# Altium project MSXIV_Rear_Power_Distribution.PrjPcb (part 4 of 4)

## Sheet Power Distribution - Output to front Power Board.SchDoc: Output to Front Power Distribution
size B; Organization: Midnight Sun Solar Rayce Car Team; Address1: University of Waterloo; Address2: 200 University Ave W; Address3: Waterloo, ON, Canada; Address4: N2L 3E9; Website: www.uwmidsun.com; ProjectName: ProjectName
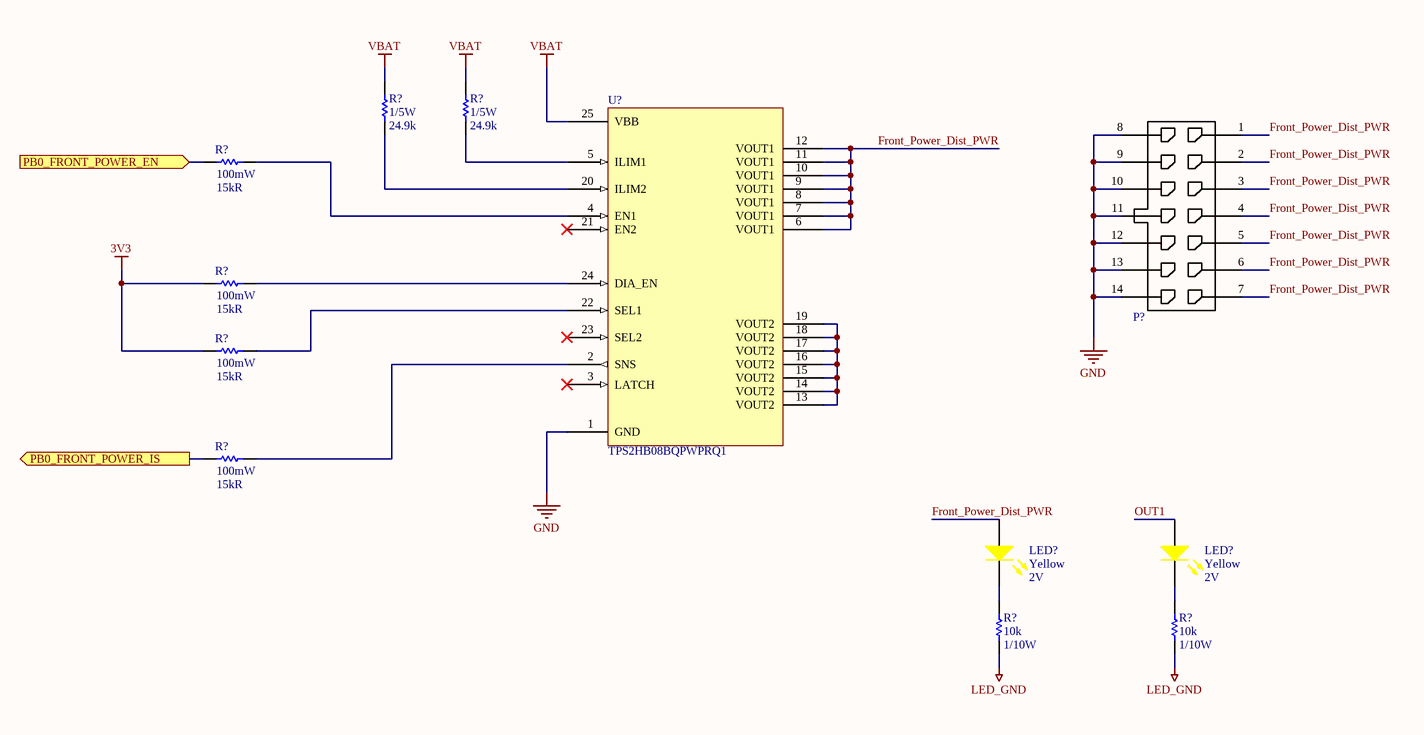
[diagram p14: Power Distribution - Output to front Power Board.SchDoc]

### Parts
(Parts that share a designator on the sheet are numbered #1, #2 ... from top to bottom, then left to right.)
LED?#3  Color: Yellow  Voltage - Forward (Vf) (Typ): 2V  [LED_0603]  (hidden comment: LED YELLOW CLEAR 2.1V 0603)
LED?#4  Color: Yellow  Voltage - Forward (Vf) (Typ): 2V  [LED_0603]  (hidden comment: LED YELLOW CLEAR 2.1V 0603)
P?#9  CONN 14POS MICRO-FIT 3mm  [CONN, 14POS MICRO-FIT 3mm]  (value not drawn)
R?#20  Power: 1/5W  Resistance: 24.9k  [RES, 0603]  (hidden comment: RES 24.9K OHM 0.1% 1/5W 0603)
R?#21  Power: 1/5W  Resistance: 24.9k  [RES, 0603]  (hidden comment: RES 24.9K OHM 0.1% 1/5W 0603)
R?#22  Power Rating: 100mW  Resistance: 15kR  [RES, 0603]  (hidden comment: RES SMD 15K OHM 1% 1/10W 0603)
R?#23  Power Rating: 100mW  Resistance: 15kR  [RES, 0603]  (hidden comment: RES SMD 15K OHM 1% 1/10W 0603)
R?#24  Power Rating: 100mW  Resistance: 15kR  [RES, 0603]  (hidden comment: RES SMD 15K OHM 1% 1/10W 0603)
R?#25  Power Rating: 100mW  Resistance: 15kR  [RES, 0603]  (hidden comment: RES SMD 15K OHM 1% 1/10W 0603)
R?#26  Resistance: 10k  Power: 1/10W  [RES, 0603]  (hidden comment: RES 10K OHM 1% 1/10W 0603)
R?#27  Resistance: 10k  Power: 1/10W  [RES, 0603]  (hidden comment: RES 10K OHM 1% 1/10W 0603)
U?#6  Manufacturer Part Number: TPS2HB08BQPWPRQ1  [IC TPS2HB08-Q1 PowerPAD TSSOP-24]  (hidden comment: IC LOAD SWITCH TPS2HB08BQPWPRQ1 24-TSSOP)

### Ports
PB0_FRONT_POWER_EN (in), PB0_FRONT_POWER_IS (out)

### Nets
3V3: R?#23.1 R?#24.1
GND: P?#9.8 P?#9.9 P?#9.10 P?#9.11 P?#9.12 P?#9.13 P?#9.14 U?#6.1(GND)  [project net AUX_BAT_IN]
LED_GND: R?#26.2 R?#27.2
VBAT: R?#20.2 R?#21.2 U?#6.25(VBB)
Front_Power_Dist_PWR: LED?#3.1(A) P?#9.1 P?#9.2 P?#9.3 P?#9.4 P?#9.5 P?#9.6 P?#9.7 U?#6.6(VOUT1) U?#6.7(VOUT1) U?#6.8(VOUT1) U?#6.9(VOUT1) U?#6.10(VOUT1) U?#6.11(VOUT1) U?#6.12(VOUT1)
OUT1: LED?#4.1(A)
NetLED?#3_2: LED?#3.2(K) R?#26.1
NetLED?#4_2: LED?#4.2(K) R?#27.1
NetR?#20_1: R?#20.1 U?#6.20(ILIM2)
NetR?#21_1: R?#21.1 U?#6.5(ILIM1)
NetR?#22_1: R?#22.1 ; port PB0_FRONT_POWER_EN
NetR?#22_2: R?#22.2 U?#6.4(EN1)
NetR?#23_2: R?#23.2 U?#6.24(DIA_EN)
NetR?#24_2: R?#24.2 U?#6.22(SEL1)
NetR?#25_1: R?#25.1 ; port PB0_FRONT_POWER_IS
NetR?#25_2: R?#25.2 U?#6.2(SNS)
NetU?#6_13: U?#6.13(VOUT2) U?#6.14(VOUT2) U?#6.15(VOUT2) U?#6.16(VOUT2) U?#6.17(VOUT2) U?#6.18(VOUT2) U?#6.19(VOUT2)

Not connected (* = marked no-connect by the designer): U?#6 3(LATCH)* 21(EN2)* 23(SEL2)*

### Notes on the sheet
- PROJECT
- DOCUMENT
- DRAWN BY
- LAST MODIFIED
- PART NUMBER
- REVISION
- SHEET
- VARIANT
- OF
- Engineering 5 - 1002
  University of Waterloo
  (519) 888-4567 x32978
  hardware@uwmidsun.com

### Library data of the parts
LED?#3 LED?#4 = LED YELLOW CLEAR 2.1V 0603: Yellow 590nm LED Indication - Discrete 2V 0603 (1608 Metric); Manufacturer: Wurth Electronics Inc.; Manufacturer Part Number: 150060YS75000; Lens Color: Colorless; Millicandela Rating: 120mcd; Lens Style/Size: Rectangle with Flat Top, 1.10mm x 0.70mm; Current - Test: 20mA; Viewing Angle: 140°; Wavelength - Peak: 595nm; Supplier 1: Digi-Key; RoHS: RoHS Compliant; Category: Optoelectronics; Stock 1: 10523; Pricing 1: 1=0.21, 100=0.1617, 500=0.13964 (CAD); Packaging: Cut Tape (CT); Part Status: Active; Lens Transparency: Clear; Mounting Type: Surface Mount; Wavelength - Dominant: 590nm; Features: -; Package / Case: 0603 (1608 Metric); Supplier Device Package: 0603; Size / Dimension: 1.60mm L x 0.80mm W; Height (Max): 0.80mm; ComponentLink1URL: http://katalog.we-online.de/led/datasheet/150060YS75000.pdf; ComponentLink1Description: http://katalog.we-online.de/led/datasheet/150060YS75000.pdf; Supplier Part Number 1: 732-4981-1-ND
P?#9 = CONN 14POS MICRO-FIT 3mm: Connector Header Through Hole 14 position 0.118" (3.00mm); Manufacturer: Molex, LLC; Manufacturer Part Number: 0430451427; Number of Positions: 14; Number of Positions Loaded: All; Style: Board to Cable/Wire; Shrouding: Shrouded - 4 Wall; Contact Length - Post: 0.125" (3.18mm); Material Flammability Rating: UL94 V-0; Supplier 1: Digi-Key; RoHS: RoHS Compliant; Category: Connectors, Interconnects; Stock 1: 829; Pricing 1: 1=4.57, 10=4.377, 25=4.0124, 50=3.8296, 100=3.6473, 250=3.1914, 936=2.82666, 1872=2.5531, 2808=2.46192 (CAD); Packaging: Tray; Part Status: Active; Connector Type: Header; Contact Type: Male Pin; Pitch - Mating: 0.118" (3.00mm); Number of Rows: 2; Row Spacing - Mating: 0.118" (3.00mm); Mounting Type: Through Hole; Termination: Solder; Fastening Type: Locking Ramp; Contact Length - Mating: -; Overall Contact Length: -; Insulation Height: 0.390" (9.91mm); Contact Shape: Square; Contact Finish - Mating: Tin; Contact Finish Thickness - Mating: 60.0µin (1.52µm); Contact Finish - Post: Tin; Contact Material: Brass; Insulation Material: Liquid Crystal Polymer (LCP), Glass Filled; Features: Board Guide; Operating Temperature: -; Ingress Protection: -; Insulation Color: Black; Current Rating: -; Voltage Rating: -; Mated Stacking Heights: -; Contact Finish Thickness - Post: -; Applications: General Purpose, Medical, Military, Telecommunications; ComponentLink1URL: https://www.molex.com/pdm_docs/sd/430451427_sd.pdf; ComponentLink1Description: https://www.molex.com/pdm_docs/sd/430451427_sd.pdf; Supplier Part Number 1: WM10707-ND
R?#20 R?#21 = RES 24.9K OHM 0.1% 1/5W 0603: 24.9 kOhms ±0.1% 0.2W, 1/5W Chip Resistor 0603 (1608 Metric) Automotive AEC-Q200, Pulse Withstanding Thick Film; Manufacturer: Panasonic; Manufacturer Part Number: ERJPB3B2492V; Max Power Dissipation: 200mW; Temperature Coefficient: 50ppm/°C; Supplier 1: Digi-Key; Supplier Part Number 1: P20129CT-ND; Stock 1: 2; Pricing 1: 1=0.25000, 10=0.21100, 25=0.15320, 50=0.11100, 100=0.08230, 250=0.06316, 500=0.04976, 1000=0.03445 (USD); RoHS: Yes; Case/Package: 0603; Case Code (Metric): 1608; Case Code (Imperial): 0603; Min Operating Temperature: -55°C; Max Operating Temperature: 155°C; Packaging: Tape and Reel; Composition: Thick Film; Number of Terminations: 2; Tolerance: 0.1%; Features: Automotive AEC-Q200; Length: 0.063inch; Width: 0.032inch; Height - Seated (Max): 0.022inch; ComponentLink1URL: http://www.farnell.com/datasheets/2286937.pdf?src-supplier=Farnell; ComponentLink1Description: http://www.farnell.com/datasheets/2286937.pdf?src-supplier=Farnell; ComponentLink2URL: https://industrial.panasonic.com/sa/system/files/data/download/catalog/id_fixed-resistors_e_2.pdf?src-supplier=Digi-Key; ComponentLink2Description: https://industrial.panasonic.com/sa/system/files/data/download/catalog/id_fixed-resistors_e_2.pdf?src-supplier=Digi-Key; ComponentLink3URL: https://industrial.panasonic.com/cdbs/www-data/pdf/RDM0000/DMM0000COL5.pdf?src-supplier=Digi-Key; ComponentLink3Description: https://industrial.panasonic.com/cdbs/www-data/pdf/RDM0000/DMM0000COL5.pdf?src-supplier=Digi-Key; ComponentLink4URL: http://www.farnell.com/datasheets/2286937.pdf?src-supplier=Newark; ComponentLink4Description: http://www.farnell.com/datasheets/2286937.pdf?src-supplier=Newark
R?#22-R?#25 = RES SMD 15K OHM 1% 1/10W 0603: 15 kOhms ±1% 0.1W, 1/10W Chip Resistor 0603 (1608 Metric) Moisture Resistant Thick Film; Manufacturer: Yageo; Manufacturer Part Number: RC0603FR-0715KL; Temperature Coefficient: 100ppm/°C; Voltage Rating (DC): 50V; Supplier 1: Digi-Key; RoHS: Yes; Stock 1: 8520111; Pricing 1: 1 = 0.10000, 10 = 0.02400, 100 = 0.00970, 1000 = 0.00437, 2500 = 0.00379 (USD); Case/Package: 0603; Number of Pins: 2; Case Code (Metric): 1608; Case Code (Imperial): 0603; Min Operating Temperature: -55°C; Max Operating Temperature: 155°C; Tolerance: 1%; Packaging: Tape and Reel; Composition: Thick Film; Package Quantity: 1; Voltage Rating: 50V; Number of Terminations: 2; Termination: SMD/SMT; Military Standard: Not; Max Power Dissipation: 100mW; Features: Moisture Resistant; Length: 1.6mm; Height: 0.022inch; Width: 0.031inch; Depth: 0.8mm; REACH SVHC: Unknown; Lead Free: Lead Free; ComponentLink1URL: http://www.yageo.com/documents/recent/PYu-RC_Group_51_RoHS_L_10.pdf; ComponentLink1Description: http://www.yageo.com/documents/recent/PYu-RC_Group_51_RoHS_L_10.pdf; ComponentLink2URL: http://www.yageo.com/documents/recent/PYu-RC_Group_51_RoHS_L_9.pdf; ComponentLink2Description: http://www.yageo.com/documents/recent/PYu-RC_Group_51_RoHS_L_9.pdf; ComponentLink3URL: https://www.verical.com/server-webapp/html/getDatasheet?partID=327895; ComponentLink3Description: https://www.verical.com/server-webapp/html/getDatasheet?partID=327895; Supplier Part Number 1: 311-15.0KHRCT-ND
R?#26 R?#27 = RES 10K OHM 1% 1/10W 0603: RES SMD 10K OHM 1% 1/10W 0603; Manufacturer 1: Yageo; Manufacturer Part Number 1: RC0603FR-0710KL; Temperature Coefficient: ±100ppm/°C; Supplier 1: Digi-Key; Supplier Part Number 1: 311-10.0KHRCT-ND; Packaging: Cut Tape (CT); Part Status: Active; Composition: Thick Film; Operating Temperature: -55°C ~ 155°C; Package / Case: 0603 (1608 Metric); Supplier Device Package: 0603; Size / Dimension: 0.063" L x 0.031" W (1.60mm x 0.80mm); Height - Seated (Max): 0.022" (0.55mm); Failure Rate: -; ComponentLink1URL: http://www.yageo.com/documents/recent/PYu-RC_Group_51_RoHS_L_7.pdf; ComponentLink1Description: http://www.yageo.com/documents/recent/PYu-RC_Group_51_RoHS_L_7.pdf; Tolerance: ±1%
U?#6 = IC LOAD SWITCH TPS2HB08BQPWPRQ1 24-TSSOP: Power Switch ICs - Power Distribution HYDRA 8 MOHM OTP B; Manufacturer: Texas Instruments; Supplier 1: Mouser; Supplier Part Number 1: 595-TPS2HB08BQPWPRQ1; Stock 1: 1455; Pricing 1: 1=6.26000, 10=5.63000, 50=5.63000, 100=4.61000, 1000=3.31000, 10000=3.14000 (USD); ComponentLink1URL: https://octopart.com/click/track?ak=2673a2b2&ct=datasheets&sig=00f1c14&at=physicalpart&sid=370&ppid=97400712&hlid=26833906&src-supplier=TI+store; ComponentLink1Description: https://octopart.com/click/track?ak=2673a2b2&ct=datasheets&sig=00f1c14&at=physicalpart&sid=370&ppid=97400712&hlid=26833906&src-supplier=TI+store; ComponentLink2URL: http://sigma.octopart.com/49250897/technical_drawing/Texas-Instruments-TPS2HB08BQPWPRQ1.pdf?src-supplier=TI+store; ComponentLink2Description: http://sigma.octopart.com/49250897/technical_drawing/Texas-Instruments-TPS2HB08BQPWPRQ1.pdf?src-supplier=TI+store

## Sheet Power Distribution - External ADC.SchDoc: External ADC
size B; Organization: Midnight Sun Solar Rayce Car Team; Address1: University of Waterloo; Address2: 200 University Ave W; Address3: Waterloo, ON, Canada; Address4: N2L 3E9; Website: www.uwmidsun.com; ProjectName: ProjectName
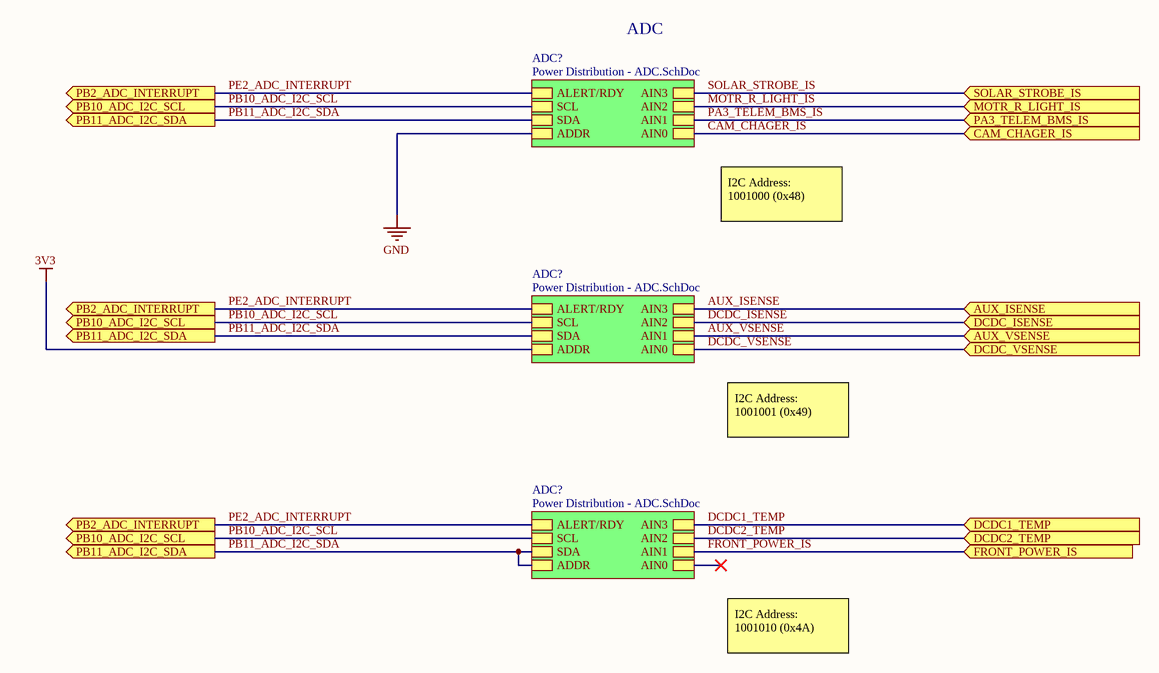
[diagram p15: Power Distribution - External ADC.SchDoc]

### Sub-sheets
ADC? = Power Distribution - ADC.SchDoc: ALERT/RDY, SCL, SDA, ADDR, AIN3, AIN2, AIN1, AIN0
ADC? = Power Distribution - ADC.SchDoc: ALERT/RDY, SCL, SDA, ADDR, AIN3, AIN2, AIN1, AIN0
ADC? = Power Distribution - ADC.SchDoc: ALERT/RDY, SCL, SDA, ADDR, AIN3, AIN2, AIN1, AIN0

### Ports
AUX_ISENSE (in), AUX_VSENSE (in), CAM_CHAGER_IS (in), DCDC1_TEMP (in), DCDC2_TEMP (in), DCDC_ISENSE (in), DCDC_VSENSE (in), FRONT_POWER_IS (in), MOTR_R_LIGHT_IS (in), PA3_TELEM_BMS_IS (in), PB2_ADC_INTERRUPT (out), PB10_ADC_I2C_SCL (out), PB11_ADC_I2C_SDA (out), SOLAR_STROBE_IS (in)

### Nets
AUX_ISENSE: port AUX_ISENSE, sheet ADC?/AIN3
AUX_VSENSE: port AUX_VSENSE, sheet ADC?/AIN1
CAM_CHAGER_IS: port CAM_CHAGER_IS, sheet ADC?/AIN0
DCDC1_TEMP: port DCDC1_TEMP, sheet ADC?/AIN3
DCDC2_TEMP: port DCDC2_TEMP, sheet ADC?/AIN2
DCDC_ISENSE: port DCDC_ISENSE, sheet ADC?/AIN2
DCDC_VSENSE: port DCDC_VSENSE, sheet ADC?/AIN0
FRONT_POWER_IS: port FRONT_POWER_IS, sheet ADC?/AIN1
MOTR_R_LIGHT_IS: port MOTR_R_LIGHT_IS, sheet ADC?/AIN2
PA3_TELEM_BMS_IS: port PA3_TELEM_BMS_IS, sheet ADC?/AIN1
PB10_ADC_I2C_SCL: port PB10_ADC_I2C_SCL, sheet ADC?/SCL, sheet ADC?/SCL, sheet ADC?/SCL
PB11_ADC_I2C_SDA: port PB11_ADC_I2C_SDA, sheet ADC?/SDA, sheet ADC?/SDA, sheet ADC?/SDA, sheet ADC?/ADDR
PE2_ADC_INTERRUPT: port PB2_ADC_INTERRUPT, sheet ADC?/ALERT/RDY, sheet ADC?/ALERT/RDY, sheet ADC?/ALERT/RDY
SOLAR_STROBE_IS: port SOLAR_STROBE_IS, sheet ADC?/AIN3

### Notes on the sheet
- ADC
- I2C Address: 1001000 (0x48)
- I2C Address: 1001001 (0x49)
- I2C Address: 1001010 (0x4A)
- PROJECT
- DOCUMENT
- DRAWN BY
- LAST MODIFIED
- PART NUMBER
- REVISION
- SHEET
- VARIANT
- OF
- Engineering 5 - 1002
  University of Waterloo
  (519) 888-4567 x32978
  hardware@uwmidsun.com

## Sheet Power Distribution - ADC.SchDoc: Title
size B; Organization: Midnight Sun Solar Rayce Car Team; Address1: University of Waterloo; Address2: 200 University Ave W; Address3: Waterloo, ON, Canada; Address4: N2L 3E9; Website: www.uwmidsun.com; ProjectName: ProjectName
Used 3 times, as channels ADC?, ADC?, ADC?. Parts and nets are listed once, with the designators drawn on the sheet.
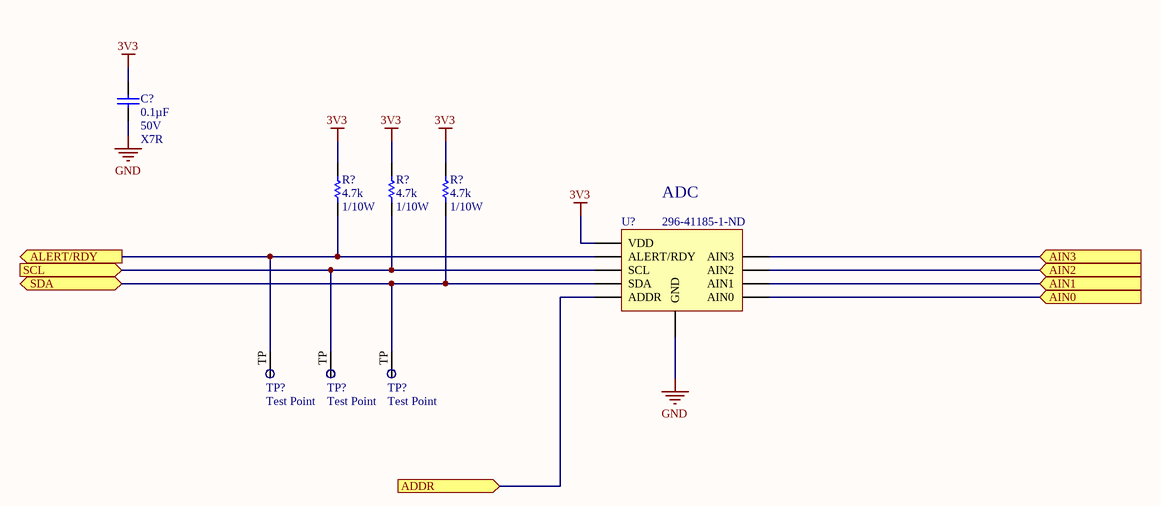
[diagram p16: Power Distribution - ADC.SchDoc]

### Parts
(Parts that share a designator on the sheet are numbered #1, #2 ... from top to bottom, then left to right.)
C?  Capacitance: 0.1µF  Voltage: 50V  Temperature Coefficient: X7R  [CAP, 0603]  (hidden comment: CAP CER 0.1UF 50V 10% X7R 0603)
R?#1  Resistance (Ohms): 4.7k  Power (Watts): 1/10W  [RES, 0603]  (hidden comment: RES 4.7K OHM 1% 1/10W 0603)
R?#2  Resistance (Ohms): 4.7k  Power (Watts): 1/10W  [RES, 0603]  (hidden comment: RES 4.7K OHM 1% 1/10W 0603)
R?#3  Resistance (Ohms): 4.7k  Power (Watts): 1/10W  [RES, 0603]  (hidden comment: RES 4.7K OHM 1% 1/10W 0603)
TP?#1  Test Point  [Test Point]  (no BOM)
TP?#2  Test Point  [Test Point]  (no BOM)
TP?#3  Test Point  [Test Point]  (no BOM)
U?  Supplier Part Number 1: 296-41185-1-ND  [IC ADC VSSOP10]  (hidden comment: Quad ADC)

### Ports
ADDR (in), AIN0 (in), AIN1 (in), AIN2 (in), AIN3 (in), ALERT/RDY (out), SCL (in), SDA (bidir)

### Nets
3V3: C?.1 R?#1.1 R?#2.1 R?#3.1 U?.8(VDD)
GND: C?.2 U?.3(GND)
ADDR: U?.1(ADDR) ; port ADDR
AIN0: U?.4(AIN0) ; port AIN0
AIN1: U?.5(AIN1) ; port AIN1
AIN2: U?.6(AIN2) ; port AIN2
AIN3: U?.7(AIN3) ; port AIN3
ALERT/RDY: R?#1.2 TP?#1.TP U?.2(ALERT/RDY) ; port ALERT/RDY
SCL: R?#2.2 TP?#2.TP U?.10(SCL) ; port SCL
SDA: R?#3.2 TP?#3.TP U?.9(SDA) ; port SDA

### Channels
ADC?: designators C?=C?_ADC?#1 R?=R?_ADC?#1 R?=R?_ADC?#2 R?=R?_ADC?#3 TP?=TP?_ADC?#3 TP?=TP?_ADC?#2 TP?=TP?_ADC?#1 U?=U?_ADC?#1; ports ADDR=AUX_BAT_IN AIN0=CAM_CHAGER_IS AIN1=PA3_TELEM_BMS_IS AIN2=MOTR_R_LIGHT_IS AIN3=SOLAR_STROBE_IS ALERT/RDY=PE2_ADC_INTERRUPT SCL=PB10_ADC_I2C_SCL SDA=PB11_ADC_I2C_SDA
ADC?: designators C?=C?_ADC?#2 R?=R?_ADC?#4 R?=R?_ADC?#5 R?=R?_ADC?#6 TP?=TP?_ADC?#6 TP?=TP?_ADC?#5 TP?=TP?_ADC?#4 U?=U?_ADC?#2; ports ADDR=3V3 AIN0=DCDC_VSENSE AIN1=AUX_VSENSE AIN2=DCDC_ISENSE AIN3=AUX_ISENSE ALERT/RDY=PE2_ADC_INTERRUPT SCL=PB10_ADC_I2C_SCL SDA=PB11_ADC_I2C_SDA
ADC?: designators C?=C?_ADC?#3 R?=R?_ADC?#7 R?=R?_ADC?#8 R?=R?_ADC?#9 TP?=TP?_ADC?#9 TP?=TP?_ADC?#8 TP?=TP?_ADC?#7 U?=U?_ADC?#3; ports ADDR=PB11_ADC_I2C_SDA AIN0=NetU?_ADC?#3_4 AIN1=FRONT_POWER_IS AIN2=DCDC2_TEMP AIN3=DCDC1_TEMP ALERT/RDY=PE2_ADC_INTERRUPT SCL=PB10_ADC_I2C_SCL SDA=PB11_ADC_I2C_SDA

### Notes on the sheet
- (near U?) ADC
- PROJECT
- DOCUMENT
- DRAWN BY
- LAST MODIFIED
- PART NUMBER
- REVISION
- SHEET
- VARIANT
- OF
- Engineering 5 - 1002
  University of Waterloo
  (519) 888-4567 x32978
  hardware@uwmidsun.com

### Library data of the parts
C? = CAP CER 0.1UF 50V 10% X7R 0603: 0.10µF ±10% 50V Ceramic Capacitor X7R 0603 (1608 Metric); Manufacturer 1: AVX Corporation; Manufacturer Part Number 1: 06035C104KAT2A; Supplier 1: Digi-Key; Supplier Part Number 1: 478-5052-1-ND; Packaging: Cut Tape (CT); Part Status: Active; Operating Temperature: -55°C ~ 125°C; Ratings: -; Mounting Type: Surface Mount, MLCC; Package / Case: 0603 (1608 Metric); Size / Dimension: 0.063" L x 0.032" W (1.60mm x 0.81mm); Height - Seated (Max): -; Thickness (Max): 0.035" (0.90mm); Lead Spacing: -; Lead Style: -; ComponentLink1URL: http://datasheets.avx.com/X7RDielectric.pdf; ComponentLink1Description: http://datasheets.avx.com/X7RDielectric.pdf; Tolerance: ±10%
R?#1-R?#3 = RES 4.7K OHM 1% 1/10W 0603: 4.7k Ohm ±1% 0.1W, 1/10W Chip Resistor 0603 (1608 Metric) Moisture Resistant Thick Film; Manufacturer 1: Yageo; Manufacturer Part Number 1: RC0603FR-074K7L; Description 1: RES SMD 4.7K OHM 1% 1/10W 0603; Temperature Coefficient: ±100ppm/°C; Supplier 1: Digi-Key; Supplier Part Number 1: 311-4.70KHRCT-ND; RoHS: RoHS Compliant; Category: Resistors; Stock 1: 3487566; Pricing 1: 1=0.16, 10=0.022, 100=0.0089, 1000=0.00402, 2500=0.00349 (CAD); Packaging: Cut Tape (CT); Part Status: Active; Composition: Thick Film; Features: Moisture Resistant; Operating Temperature: -55°C ~ 155°C; Package / Case: 0603 (1608 Metric); Supplier Device Package: 0603; Size / Dimension: 0.063" L x 0.031" W (1.60mm x 0.80mm); Height - Seated (Max): 0.022" (0.55mm); Failure Rate: -; ComponentLink1URL: http://www.yageo.com/documents/recent/PYu-RC_Group_51_RoHS_L_7.pdf; ComponentLink1Description: http://www.yageo.com/documents/recent/PYu-RC_Group_51_RoHS_L_7.pdf; Tolerance: ±1%
U? = IC ADC 12-BIT VSSOP-10: 12 Bit Analog to Digital Converter 4 Input 1 Sigma-Delta 10-VSSOP; Manufacturer: Texas Instruments; Manufacturer Part Number: ADS1015IDGSR; Number of Bits: 12; Sampling Rate (Per Second): 3.3k; Number of Inputs: 2, 4; Input Type: Differential, Single Ended; Data Interface: I²C; Configuration: MUX-PGA-ADC; Number of A/D Converters: 1; Reference Type: Internal; Voltage - Supply, Analog: 2 V ~ 5.5 V; Supplier 1: Digi-Key; RoHS: RoHS Compliant; Category: Integrated Circuits (ICs); Stock 1: 4084; Pricing 1: 1=4.25, 10=3.807, 100=3.1194, 500=2.65552, 1000=2.23959 (CAD); Packaging: Cut Tape (CT); Part Status: Active; Ratio - S/H:ADC: -; Architecture: Sigma-Delta; Voltage - Supply, Digital: 2 V ~ 5.5 V; Features: PGA, Selectable Address; Operating Temperature: -40°C ~ 125°C; Package / Case: 10-TFSOP, 10-MSOP (0.118", 3.00mm Width); Supplier Device Package: 10-VSSOP; ComponentLink1URL: http://www.ti.com/lit/ds/symlink/ads1013.pdf; ComponentLink1Description: http://www.ti.com/lit/ds/symlink/ads1013.pdf

## Sheet Power Distribution - IO Expander.SchDoc: Title
size B; Organization: Midnight Sun Solar Rayce Car Team; Address1: University of Waterloo; Address2: 200 University Ave W; Address3: Waterloo, ON, Canada; Address4: N2L 3E9; Website: www.uwmidsun.com; ProjectName: ProjectName
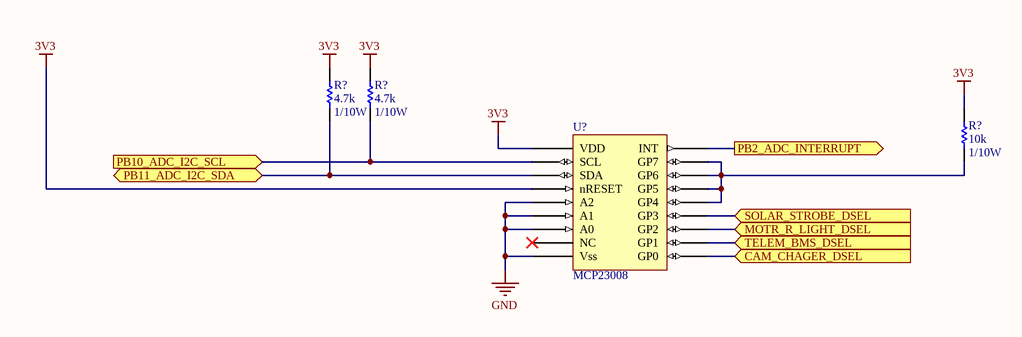
[diagram p17: Power Distribution - IO Expander.SchDoc]

### Parts
(Parts that share a designator on the sheet are numbered #1, #2 ... from top to bottom, then left to right.)
R?#28  Resistance (Ohms): 4.7k  Power (Watts): 1/10W  [RES, 0603]  (hidden comment: RES 4.7K OHM 1% 1/10W 0603)
R?#29  Resistance (Ohms): 4.7k  Power (Watts): 1/10W  [RES, 0603]  (hidden comment: RES 4.7K OHM 1% 1/10W 0603)
R?#30  Resistance: 10k  Power: 1/10W  [RES, 0603]  (hidden comment: RES 10K OHM 1% 1/10W 0603)
U?#7  MCP23008  [IC 18SOIC]

### Ports
CAM_CHAGER_DSEL (in), MOTR_R_LIGHT_DSEL (in), PB2_ADC_INTERRUPT (out), PB10_ADC_I2C_SCL (in), PB11_ADC_I2C_SDA (bidir), SOLAR_STROBE_DSEL (in), TELEM_BMS_DSEL (in)

### Nets
3V3: R?#28.1 R?#29.1 R?#30.1 U?#7.6(nRESET) U?#7.18(VDD)
GND: U?#7.3(A2) U?#7.4(A1) U?#7.5(A0) U?#7.9(Vss)  [project net AUX_BAT_IN]
NetR?#28_2: R?#28.2 U?#7.2(SDA) ; port PB11_ADC_I2C_SDA
NetR?#29_2: R?#29.2 U?#7.1(SCL) ; port PB10_ADC_I2C_SCL
NetR?#30_2: R?#30.2 U?#7.14(GP4) U?#7.15(GP5) U?#7.16(GP6) U?#7.17(GP7)
NetU?#7_8: U?#7.8(INT) ; port PB2_ADC_INTERRUPT
NetU?#7_10: U?#7.10(GP0) ; port CAM_CHAGER_DSEL
NetU?#7_11: U?#7.11(GP1) ; port TELEM_BMS_DSEL
NetU?#7_12: U?#7.12(GP2) ; port MOTR_R_LIGHT_DSEL
NetU?#7_13: U?#7.13(GP3) ; port SOLAR_STROBE_DSEL

Not connected (* = marked no-connect by the designer): U?#7 7(NC)*

### Notes on the sheet
- PROJECT
- DOCUMENT
- DRAWN BY
- LAST MODIFIED
- PART NUMBER
- REVISION
- SHEET
- VARIANT
- OF
- Engineering 5 - 1002
  University of Waterloo
  (519) 888-4567 x32978
  hardware@uwmidsun.com

### Library data of the parts
R?#28 R?#29 = RES 4.7K OHM 1% 1/10W 0603: as R?#1 on sheet Power Distribution - ADC; Supplier 1: Digi-Key; Supplier Part Number 1: 311-4.70KHRCT-ND; RoHS: RoHS Compliant; Category: Resistors; Stock 1: 3487566; Pricing 1: 1=0.16, 10=0.022, 100=0.0089, 1000=0.00402, 2500=0.00349 (CAD); Packaging: Cut Tape (CT); Part Status: Active; Composition: Thick Film; Features: Moisture Resistant; Operating Temperature: -55°C ~ 155°C; Package / Case: 0603 (1608 Metric); Supplier Device Package: 0603; Size / Dimension: 0.063" L x 0.031" W (1.60mm x 0.80mm); Height - Seated (Max): 0.022" (0.55mm); Failure Rate: -; ComponentLink1URL: http://www.yageo.com/documents/recent/PYu-RC_Group_51_RoHS_L_7.pdf; ComponentLink1Description: http://www.yageo.com/documents/recent/PYu-RC_Group_51_RoHS_L_7.pdf; Tolerance: ±1%
R?#30 = RES 10K OHM 1% 1/10W 0603: as R?#26 on sheet Power Distribution - Output to front Power Board; Supplier 1: Digi-Key; Supplier Part Number 1: 311-10.0KHRCT-ND; Packaging: Cut Tape (CT); Part Status: Active; Composition: Thick Film; Operating Temperature: -55°C ~ 155°C; Package / Case: 0603 (1608 Metric); Supplier Device Package: 0603; Size / Dimension: 0.063" L x 0.031" W (1.60mm x 0.80mm); Height - Seated (Max): 0.022" (0.55mm); Failure Rate: -; ComponentLink1URL: http://www.yageo.com/documents/recent/PYu-RC_Group_51_RoHS_L_7.pdf; ComponentLink1Description: http://www.yageo.com/documents/recent/PYu-RC_Group_51_RoHS_L_7.pdf; Tolerance: ±1%
U?#7 = IC I/O EXPANDER I2C 8B 18SOIC: MCP23008 I/O Expander 8B+1Int 18P SOIC; Manufacturer: Microchip Technology; Manufacturer Part Number: MCP23008T-E/SO; Number of I/O: 8; Interface: I²C; Interrupt Output: Yes; Output Type: Push-Pull; Current - Output Source/Sink: 25mA; Voltage - Supply: 1.8 V ~ 5.5 V; Supplier 1: Digi-Key; Supplier Part Number 1: MCP23008T-E/SOCT-ND; RoHS: RoHS Compliant; Category: Integrated Circuits (ICs); Stock 1: 5607; Pricing 1: 1=1.62, 25=1.3548, 100=1.2431 (CAD); Packaging: Cut Tape (CT); Part Status: Active; Features: POR; Operating Temperature: -40°C ~ 125°C; Mounting Type: Surface Mount; Package / Case: 18-SOIC (0.295", 7.50mm Width); Supplier Device Package: 18-SOIC; ComponentLink1URL: http://www.microchip.com/mymicrochip/filehandler.aspx?ddocname=en021920; ComponentLink1Description: http://www.microchip.com/mymicrochip/filehandler.aspx?ddocname=en021920

## Sheet Power Distribution - Spare Load Switch.SchDoc: Title
size B; Organization: Midnight Sun Solar Rayce Car Team; Address1: University of Waterloo; Address2: 200 University Ave W; Address3: Waterloo, ON, Canada; Address4: N2L 3E9; Website: www.uwmidsun.com; ProjectName: ProjectName
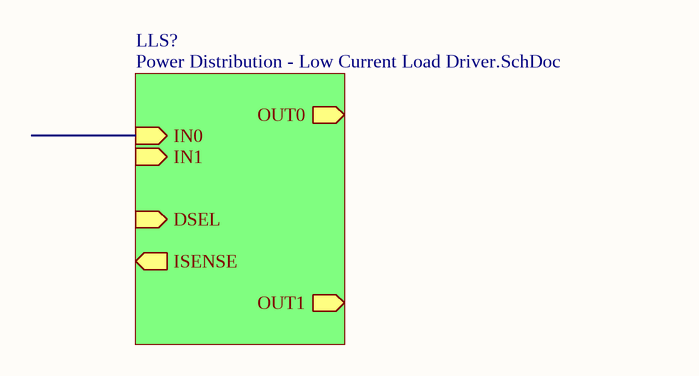
[diagram p18: Power Distribution - Spare Load Switch.SchDoc]

### Sub-sheets
LLS? = Power Distribution - Low Current Load Driver.SchDoc: IN0 (in), IN1 (in), DSEL (in), ISENSE (out), OUT0 (out), OUT1 (out)  | Parameter 1: MAX

### Notes on the sheet
- PROJECT
- DOCUMENT
- DRAWN BY
- LAST MODIFIED
- PART NUMBER
- REVISION
- SHEET
- VARIANT
- OF
- Engineering 5 - 1002
  University of Waterloo
  (519) 888-4567 x32978
  hardware@uwmidsun.com

## Nets that join several sheets
3V3: Controller_Board_Interface (10 pins), Power Distribution - Power Path (R17.1 R19.1 R?#6.1), LLS? (R?_LLS?#1.4), LLS? (R?_LLS?#9.4), LLS? (R?_LLS?#17.4), LLS? (R?_LLS?#25.4), Power Distribution - Output to front Power Board (R?#23.1 R?#24.1), ADC? (5 pins), ADC? (6 pins), ADC? (5 pins), Power Distribution - IO Expander (5 pins), LLS? (R?_LLS?#33.4)
AUX_BAT_IN: Controller_Board_Interface (15 pins), Power Distribution - Power Supply (5 pins), Power Distribution - DC-DC (19 pins), Power Distribution - Temperature Sense (8 pins), Power Distribution - Aux Battery (22 pins), Power Distribution - Power Path (11 pins), Designator (C?_Designator#1.2), Power Distribution - Power Path 2 Parallel MOSFET (C?#9.2), Designator (C?_Designator#2.2), Power Distribution - Hight Current Load Switch (U?#5.1), Power Distribution - Solar Sense and Strobe Light (P?#2.2 P?#3.2), LLS? (8 pins), Power Distribution - Motor Interface and Rear light (rear board) (P?#4.2 P?#5.2), LLS? (8 pins), Power Distribution - Telemetry, BMS, Rear camera, and Charger (rear board) (6 pins), LLS? (8 pins), LLS? (8 pins), Power Distribution - PJB (5 pins), Power Distribution - Output to front Power Board (8 pins), ADC? (C?_ADC?#1.2 U?_ADC?#1.1 U?_ADC?#1.3), ADC? (C?_ADC?#2.2 U?_ADC?#2.3), ADC? (C?_ADC?#3.2 U?_ADC?#3.3), Power Distribution - IO Expander (U?#7.3 U?#7.4 U?#7.5 U?#7.9), LLS? (8 pins)
LDO_3V: Controller_Board_Interface (C2.1 TP2.1 U1.1), Power Distribution - DC-DC (6 pins), Power Distribution - Temperature Sense (C?#4.1 U?#2.8), Power Distribution - Aux Battery (7 pins)
LED_GND: Power Distribution - Hight Current Load Switch (R?#18.2 R?#19.2), LLS? (R?_LLS?#7.2 R?_LLS?#8.2), LLS? (R?_LLS?#15.2 R?_LLS?#16.2), LLS? (R?_LLS?#23.2 R?_LLS?#24.2), LLS? (R?_LLS?#31.2 R?_LLS?#32.2), Power Distribution - Output to front Power Board (R?#26.2 R?#27.2), LLS? (R?_LLS?#39.2 R?_LLS?#40.2)
PROT_VBAT: Controller_Board_Interface (5 pins), Power Distribution - Hight Current Load Switch (R?#11.2 R?#12.2 U?#5.25), LLS? (C?_LLS?#1.1 U?_LLS?#1.15), LLS? (C?_LLS?#5.1 U?_LLS?#2.15), LLS? (C?_LLS?#9.1 U?_LLS?#3.15), LLS? (C?_LLS?#13.1 U?_LLS?#4.15), LLS? (C?_LLS?#17.1 U?_LLS?#5.15)
VBAT: Power Distribution - Power Path (6 pins), Designator (12 pins), Power Distribution - Power Path 2 Parallel MOSFET (Q?#4.6), Designator (12 pins), Power Distribution - PJB (C35.1 D4.2 P7.1 R43.1), Power Distribution - Output to front Power Board (R?#20.2 R?#21.2 U?#6.25)
AUX_FUSED: Power Distribution - Power Path (C21.1 R21.1 U6.22), Power Distribution - Power Path 2 Parallel MOSFET (8 pins)
BMS_PWR: Power Distribution - Telemetry, BMS, Rear camera, and Charger (rear board) (P?#7.1 P?#7.2), LLS? (6 pins)
Charger_PWR: Power Distribution - Telemetry, BMS, Rear camera, and Charger (rear board) (P?#8.1), LLS? (6 pins)
DCDC1_THERMISTOR: Power Distribution - DC-DC (P2.8), Power Distribution - Temperature Sense (C25.1 R27.1 U?#1.3)
DCDC2_THERMISTOR: Power Distribution - DC-DC (P3.8), Power Distribution - Temperature Sense (C?#5.1 R?#2.1 U?#3.5)
DCDC_FUSED: Power Distribution - Power Path (C20.1 R16.1 U6.23), Designator (12 pins)
Motor_Interface_PWR: Power Distribution - Motor Interface and Rear light (rear board) (P?#4.1), LLS? (6 pins)
OUT0: Power Distribution - Solar Sense and Strobe Light (P?#2.1), LLS? (6 pins)
OUT0: Power Distribution - Telemetry, BMS, Rear camera, and Charger (rear board) (P?#6.5 P?#6.6), LLS? (6 pins)
OUT0: Power Distribution - Telemetry, BMS, Rear camera, and Charger (rear board) (P?#6.7), LLS? (6 pins)
OUT1: Power Distribution - Solar Sense and Strobe Light (P?#3.1), LLS? (6 pins)
OUT1: Power Distribution - Motor Interface and Rear light (rear board) (P?#5.1), LLS? (6 pins)
PB10_ADC_I2C_SCL: ADC? (R?_ADC?#2.2 TP?_ADC?#2.TP U?_ADC?#1.10), ADC? (R?_ADC?#5.2 TP?_ADC?#5.TP U?_ADC?#2.10), ADC? (R?_ADC?#8.2 TP?_ADC?#8.TP U?_ADC?#3.10)
PB11_ADC_I2C_SDA: ADC? (R?_ADC?#3.2 TP?_ADC?#3.TP U?_ADC?#1.9), ADC? (R?_ADC?#6.2 TP?_ADC?#6.TP U?_ADC?#2.9), ADC? (R?_ADC?#9.2 TP?_ADC?#9.TP U?_ADC?#3.1 U?_ADC?#3.9)
PE2_ADC_INTERRUPT: ADC? (R?_ADC?#1.2 TP?_ADC?#1.TP U?_ADC?#1.2), ADC? (R?_ADC?#4.2 TP?_ADC?#4.TP U?_ADC?#2.2), ADC? (R?_ADC?#7.2 TP?_ADC?#7.TP U?_ADC?#3.2)
VG: Power Distribution - Power Path (U6.20), Designator (7 pins)
VG: Power Distribution - Power Path (U6.18), Designator (7 pins)
VG: Power Distribution - Power Path (C16.2 D3.2 R15.1), Power Distribution - Power Path 2 Parallel MOSFET (5 pins)
VS: Power Distribution - Power Path (U6.21), Designator (19 pins)
VS: Power Distribution - Power Path (U6.19), Designator (19 pins)
VS: Power Distribution - Power Path (U6.17), Power Distribution - Power Path 2 Parallel MOSFET (13 pins)